# EAGLE design Codeshelf-0010.v01 (EAGLE 5.11)
MFG: Kobiconn; MFGN: SparkFun; MFGP: BOB-11611; PRICE: 34.95
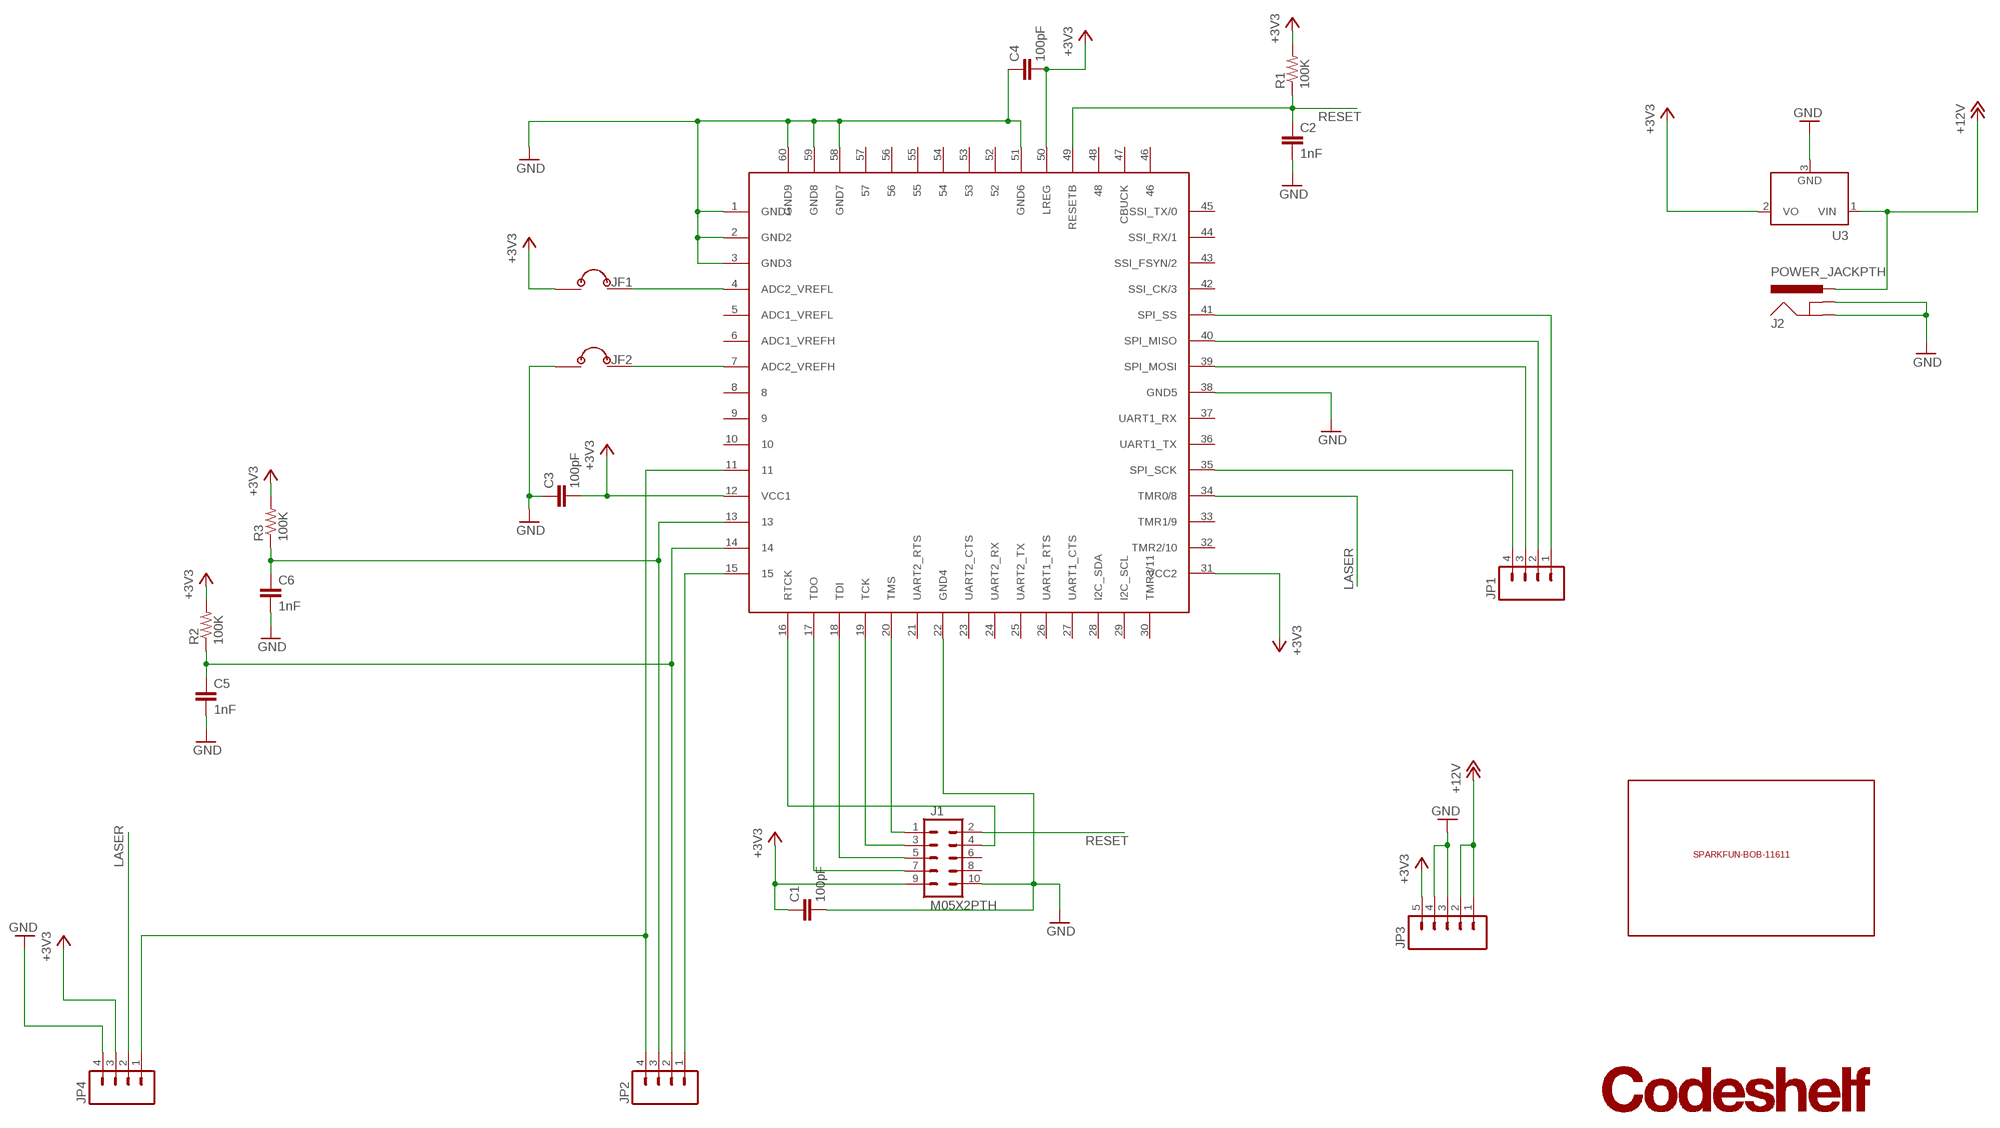
[diagram p0: schematic, sheet 1]

## Parts
C1  100pF  RF-C0603  [C0603]
C2  1nF  RF-C0603  [C0603]
C3  100pF  RF-C0603  [C0603]
C4  100pF  RF-C0603  [C0603]
C5  1nF  RF-C0603  [C0603]
C6  1nF  RF-C0603  [C0603]
J1  M05X2PTH  [AVR_ICSP]
J2  POWER_JACKPTH  [POWER_JACK_PTH]
JF1  JUMPER-2X-SMT-VIA  [JUMPER-VIA-2X]
JF2  JUMPER-2X-SMT-VIA  [JUMPER-VIA-2X]
JP1  M04PTH  [1X04]
JP2  M04PTH  [1X04]
JP3  M05PTH  [1X05]
JP4  M04PTH  [1X04]
LOGO  CODESHELF-LOGO  [CODESHELF-LOGO]
R1  100K  RF-R0402  [RF-R0402]
R2  100K  RF-R0402  [RF-R0402]
R3  100K  RF-R0402  [RF-R0402]
U1  ZSFM201-1A  [ZSFM201-1]
U3  LM2936DT-3.3  [TO252]
U$1  SPARKFUN-BOB-11611  [SPARKFUN-BOB-11611]

## Nets
#BUSY: C5.1 JP2.2 R2.1 U1.14
#FLAG: C6.1 JP2.3 R3.1 U1.13
#RESET: JP2.1 U1.15
+3V3 [3v3]: C1.1 C3.2 C4.2 J1.9 JF1.1 JP3.5 JP4.3 R1.2 R2.2 R3.2 U1.12(VCC1) U1.31(VCC2) U1.50(LREG) U3.2(VO)
+12V [12V]: J2.PWR JP3.1 JP3.2 U3.1(VIN)
GND [GND]: C1.2 C2.2 C3.1 C4.1 C5.2 C6.2 J1.10 J2.GND J2.GNDBREAK JF2.1 JP3.3 JP3.4 JP4.4 U1.1(GND1) U1.2(GND2) U1.3(GND3) U1.22(GND4) U1.38(GND5) U1.51(GND6) U1.58(GND7) U1.59(GND8) U1.60(GND9) U3.3(GND)
LASER: JP4.2 U1.34(TMR0/8)
N$6: JF2.2 U1.7(ADC2_VREFH)
N$7: JF1.2 U1.4(ADC2_VREFL)
RESET: C2.1 J1.2 R1.1 U1.49(RESETB)
RTCK: J1.4 U1.16(RTCK)
SPI_CLK: JP1.4 U1.35(SPI_SCK)
SPI_CS: JP1.1 U1.41(SPI_SS)
SPI_MISO: JP1.2 U1.40(SPI_MISO)
SPI_MOSI: JP1.3 U1.39(SPI_MOSI)
SWITCH: JP2.4 JP4.1 U1.11
TCK: J1.3 U1.19(TCK)
TDI: J1.5 U1.18(TDI)
TDO: J1.7 U1.17(TDO)
TMS: J1.1 U1.20(TMS)
Unconnected: J1.6 J1.8 U1.5(ADC1_VREFL) U1.6(ADC1_VREFH) U1.8 U1.9 U1.10 U1.21(UART2_RTS) U1.23(UART2_CTS) U1.24(UART2_RX) U1.25(UART2_TX) U1.26(UART1_RTS) U1.27(UART1_CTS) U1.28(I2C_SDA) U1.29(I2C_SCL) U1.30(TMR3/11) U1.32(TMR2/10) U1.33(TMR1/9) U1.36(UART1_TX) U1.37(UART1_RX) U1.42(SSI_CK/3) U1.43(SSI_FSYN/2) U1.44(SSI_RX/1) U1.45(SSI_TX/0) U1.46 U1.47(CBUCK) U1.48 U1.52 U1.53 U1.54 U1.55 U1.56 U1.57

## Library data of the parts
C1-C6 = GW-devices:RF-C: RF capacitor pads for FSL reference design
J1 = SparkFun:M05X2: Header 5x2 Standard 10-pin dual row 0.1" header. Commonly used with AVR-ISP. Use with Spark Fun Electronics SKU: PRT-00778
J2 = GW-devices:POWER_JACK: Power Jack This is the standard 5.5mm barrel jack for power. The PTH is the most common, proven, reliable, footprint. All others are experimental. The Slot footprint only works if the mill layer is transmitted to the PCB fab house so be warned. Spark Fun Electronics SKU : PRT-00119. Mating wall wart : TOL-00298 (and others)
JF1 JF2 = GW-devices:JUMPER-2X: This kind of jumper provides a place to place to put "green wires" for jumpering fetaure/options.
JP1 JP2 JP4 = SparkFun:M04: Header 4 Standard 4-pin 0.1" header. Use with straight break away headers (SKU : PRT-00116), right angle break away headers (PRT-00553), swiss pins (PRT-00743), machine pins (PRT-00117), and female headers (PRT-00115). Molex polarized connector foot print use with SKU : PRT-08231 with associated crimp pins and housings.
JP3 = SparkFun:M05: Header 5 Standard 5-pin 0.1" header. Use with straight break away headers (SKU : PRT-00116), right angle break away headers (PRT-00553), swiss pins (PRT-00743), machine pins (PRT-00117), and female headers (PRT-00115). Molex polarized connector foot print use with SKU : PRT-08230 with associated crimp pins and housings.
LOGO = GW-devices:CODESHELF-LOGO
R1-R3 = GW-devices:RF-R: RF resistor pads for FSL reference design
U1 = GW-devices:ZSFM201-1: The CEL MC13224V
U3 = national-semiconductor:LM2936?*: Ultra-Low Quiescent Current LDO Voltage Regulator Source: Data sheet <http://www.national.com/ds/LM/LM2936.pdf>; MPN: LM2936DT-3.3.; OC_FARNELL: 1286863; OC_NEWARK: 26M0361
U$1 = GW-devices:SPARKFUN-BOB-11611

## Net classes
1 3v3: width 0.5 mm
2 12V: width 1 mm
3 LASER: width 0.5 mm
4 GND: width 0.5 mm
5 RS485: width 0.4 mm

## Board
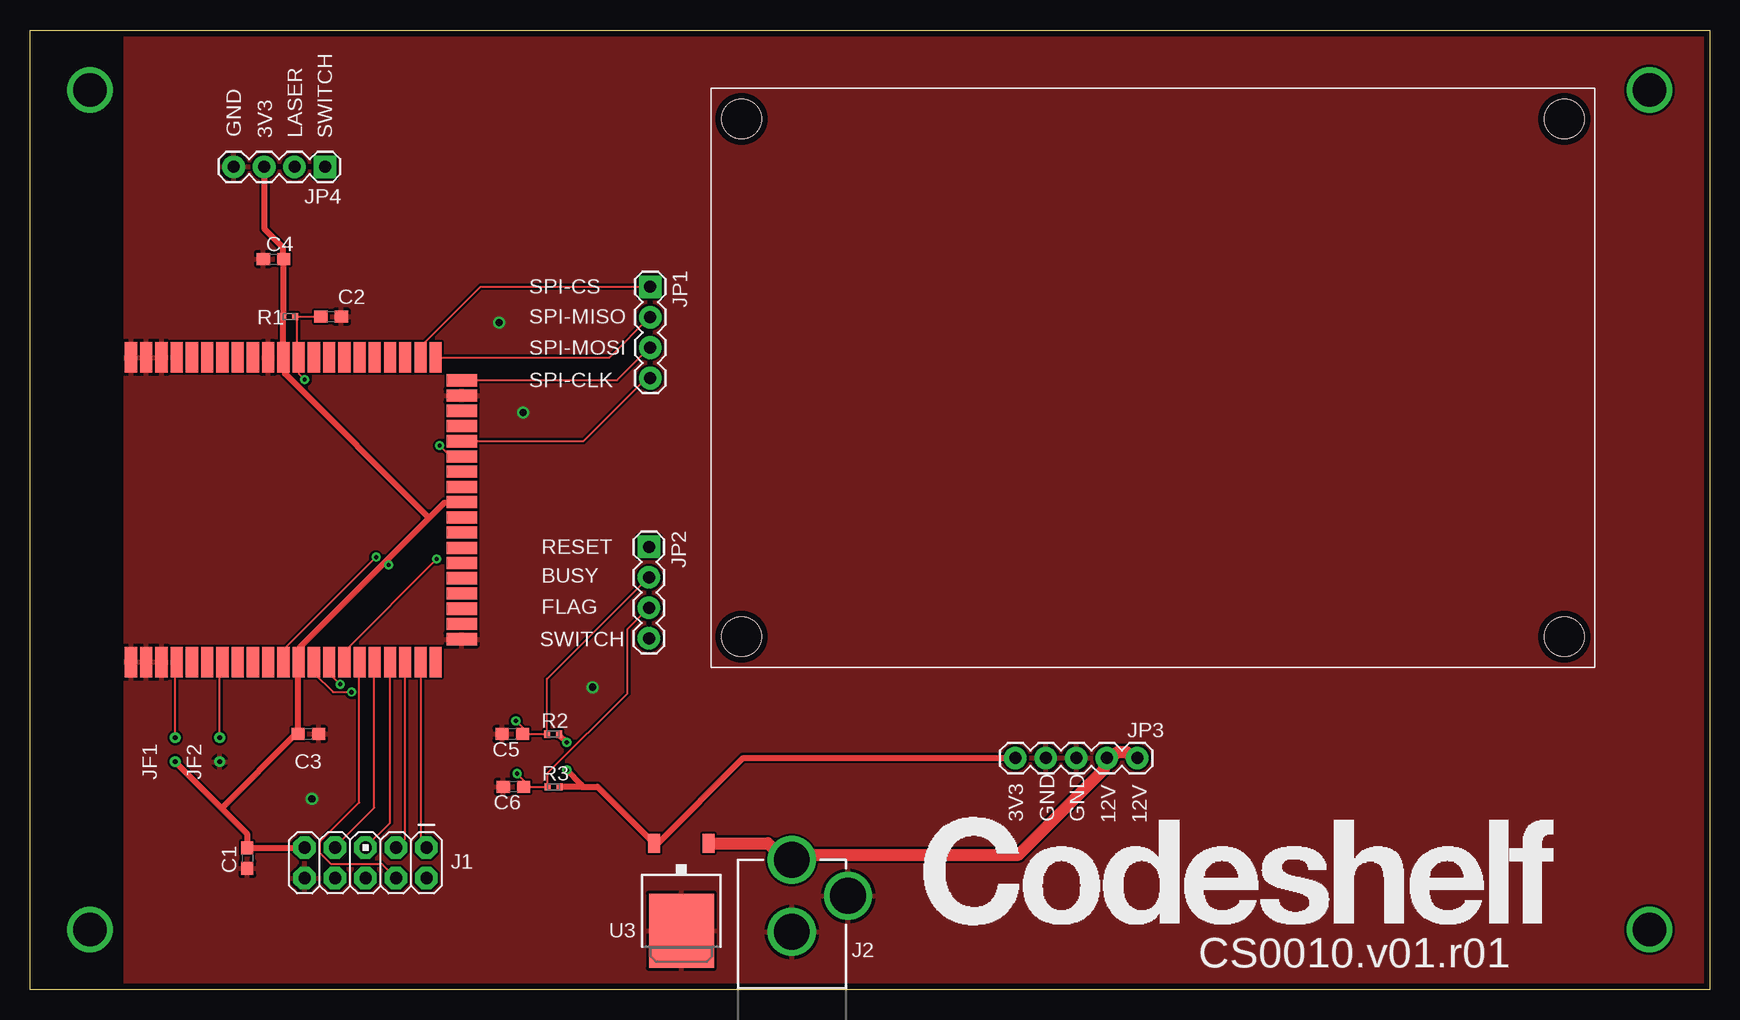
[diagram p1: board, top side]
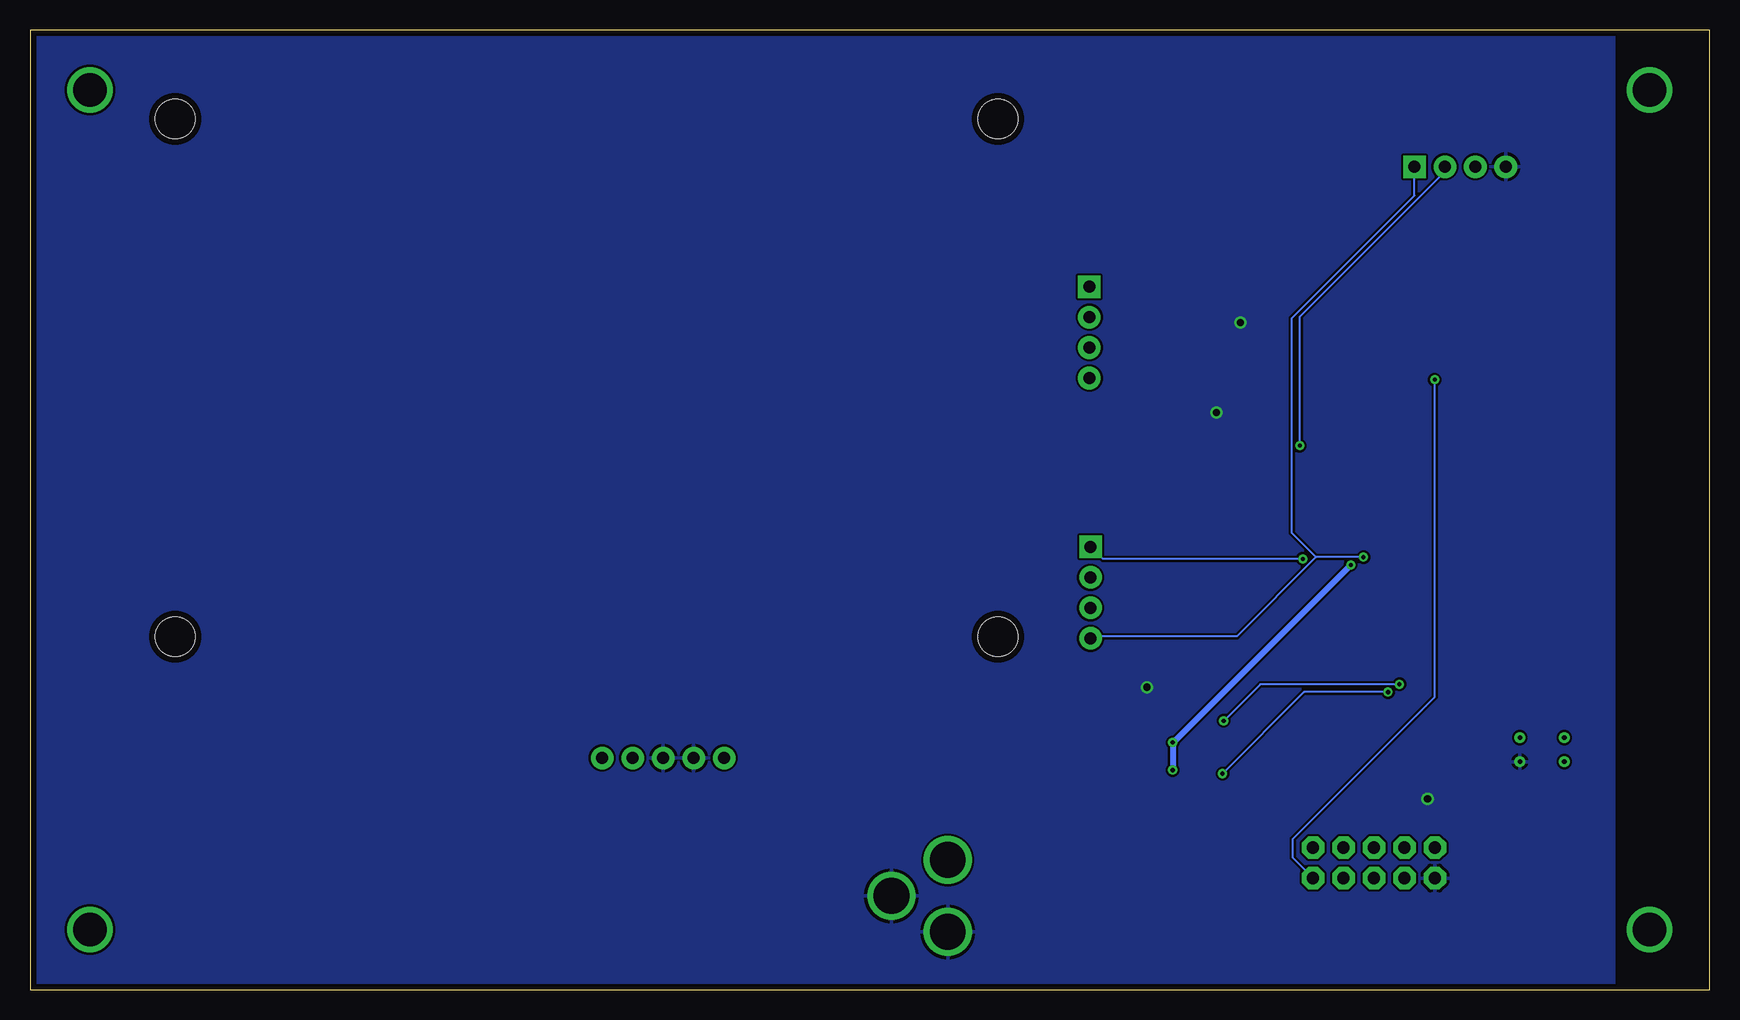
[diagram p2: board, bottom side, seen from below]

Size 140 x 80 mm. Coordinates in mm from the lower left corner, seen from the top.
Outline: 0,0 0,80 140,80 140,0 0,0
Copper layers (1*16): Top 0.0356mm / dielectric 1.5011mm / Bottom 0.0356mm
Design rules "SilverCircuits": minimum track width 7mil, minimum drill 14mil, track to track 7mil, track to pad 7mil, pad to pad 7mil, via to via 7mil, smd to smd 0mil, copper to edge 20mil, drill to drill 8mil, minimum pad ring 10mil, minimum via ring 8mil, stop-mask expansion 4mil, vias tented up to drill 0mil, thermal gap 10mil

### Footprints (pad centres in the part's own frame; a part is rotated, then mirrored left to right if it is on the bottom)
C0603 = smd 1.1 x 1: 1 -0.85,0; 2 0.85,0
AVR_ICSP = drill 1.016 pad 1.88 octagon: 1 -1.27,5.08; 2 1.27,5.08; 3 -1.27,2.54; 4 1.27,2.54; 5 -1.27,0; 6 1.27,0; 7 -1.27,-2.54; 8 1.27,-2.54; 9 -1.27,-5.08; 10 1.27,-5.08
POWER_JACK_PTH = drill 2.997: GND 0,7.7; GNDBREAK 4.7,10.7; PWR 0,13.7
JUMPER-VIA-2X = drill 0.4: 1 -1,0; 2 1,0
1X04 = drill 1.016 pad 1.88 square: 1 0,0 | drill 1.016 pad 1.88: 2 2.54,0; 3 5.08,0; 4 7.62,0
1X05 = drill 1.016 pad 1.88: 1 0,0; 2 2.54,0; 3 5.08,0; 4 7.62,0; 5 10.16,0
RF-R0402 = smd 0.5 x 0.6: 1 -0.5,0; 2 0.5,0
ZSFM201-1 = smd 2.54 x 1.016: 1 -12.7,28.829; 2 -12.7,27.559; 3 -12.7,26.289; 4 -12.7,25.019; 5 -12.7,23.749; 6 -12.7,22.479; 7 -12.7,21.209; 8 -12.7,19.939; 9 -12.7,18.669; 10 -12.7,17.399; 11 -12.7,16.129; 12 -12.7,14.859; 13 -12.7,13.589; 14 -12.7,12.319; 15 -12.7,11.049; 16 -12.7,9.779; 17 -12.7,8.509; 18 -12.7,7.239; 19 -12.7,5.969; 20 -12.7,4.699; 21 -12.7,3.429; 40 12.7,3.429; 41 12.7,4.699; 42 12.7,5.969; 43 12.7,7.239; 44 12.7,8.509; 45 12.7,9.779; 46 12.7,11.049; 47 12.7,12.319; 48 12.7,13.589; 49 12.7,14.859; 50 12.7,16.129; 51 12.7,17.399; 52 12.7,18.669; 53 12.7,19.939; 54 12.7,21.209; 55 12.7,22.479; 56 12.7,23.749; 57 12.7,25.019; 58 12.7,26.289; 59 12.7,27.559; 60 12.7,28.829 | smd 1.016 x 2.54: 22 -10.795,1.27; 23 -9.525,1.27; 24 -8.255,1.27; 25 -6.985,1.27; 26 -5.715,1.27; 27 -4.445,1.27; 28 -3.175,1.27; 29 -1.905,1.27; 30 -0.635,1.27; 31 0.635,1.27; 32 1.905,1.27; 33 3.175,1.27; 34 4.445,1.27; 35 5.715,1.27; 36 6.985,1.27; 37 8.255,1.27; 38 9.525,1.27; 39 10.795,1.27
TO252 = smd 1 x 1.6: 1 -2.28,-4.8; 2 2.28,-4.8 | smd 5.4 x 6.2: 3 0,2.5
SPARKFUN-BOB-11611 = hole 3.302: -34.29,-21.59; -34.29,21.59; 34.29,21.59; 34.29,-21.59

### Placement (x,y rotation side)
C1  18.11,10.96 270 top
C2  25.1,56.1 0 top
C3  23.2,21.3 180 top
C4  20.3,60.9 0 top
C5  40.2,21.3 180 top
C6  40.3,16.9 180 top
J1  27.97,10.56 270 top
J2  63.5,-2.9 0 top
JF1  12.1,20 90 top
JF2  15.8,20 90 top
JP1  51.7,58.6 270 top
JP2  51.6,36.9 270 top
JP3  92.3,19.3 180 top
JP4  24.6,68.6 180 top
LOGO  99.23,8.17 0 top
R1  21.6,56.1 180 top
R2  43.6,21.3 0 top
R3  43.65,16.9 0 top
U1  37.25,40 90 top
U3  54.3,7.4 180 top
U$1  93.6,51 0 top

### Tracks (layer width: path | path; a pad name or v marks a point on that pad's centre or on a via)
#BUSY  (via drill 0.36)
  Top 0.178: JP2.2 51.6,34.4 43.1,25.9 R2.1 C5.1 41.55,21.35 v40.5,22.4 | v25.85,25.45 24.95,26.35 24.95,27.3 U1.14
  Bottom 0.178: v25.85,25.45 37.45,25.45 v40.5,22.4
#FLAG  (via drill 0.36)
  Top 0.178: JP2.3 51.6,31.85 49.8,30.05 49.8,24.7 43.15,18.05 R3.1 C6.1 41.65,16.95 v40.6,18 | v26.8,24.8 25.25,24.8 23.7,26.35 23.7,27.3 U1.13
  Bottom 0.178: v26.8,24.8 33.8,24.8 v40.6,18
#RESET  (via drill 0.36)
  Top 0.178: v33.9,35.9 26.25,28.25 26.25,27.3 U1.15
  Bottom 0.178: v33.9,35.9 50.55,35.9 51.55,36.9 JP2.1
+3V3  (via drill 0.36)
  Top 0.5: 45.95,16.9 47.3,16.9 52,12.2 U3.2 52.25,12.1 59.45,19.3 JP3.5 | 45.95,16.9 R3.2 | R2.2 44.1,21.25 v44.75,20.6 | v44.75,18.3 45.95,17.1 45.95,16.9 | JP4.3 19.55,68.6 19.55,63.4 21.1,61.85 21.1,61.1 C4.2 21.15,56.3 R1.2 21.1,52.7 U1.50 21.25,52.5 21.25,51.35 33.27,39.33 | J1.9 22.85,11.8 18.15,11.8 C1.1 18.1,12.05 18.1,13 15.97,15.12 | JF1.1 15.97,15.12 | 29.62,35.67 22.5,28.55 22.5,27.5 U1.12 22.35,27.3 C3.2 22.15,21.3 15.97,15.12 | 29.62,35.67 33.27,39.33 | 33.27,39.33 34.55,40.6 35.95,40.6 U1.31 | 29.62,35.67 v29.9,35.4
  Bottom 0.5: v44.75,18.3 v44.75,20.6 44.55,20.75 v29.9,35.4
+12V
  Top 1: JP3.1 91.9,19.3 91.4,19.8 90.65,19.8 90.15,19.3 JP3.2 89.55,18.85 89.55,18.4 82.4,11.25 63.75,11.25 J2.PWR 62.9,10.8 61.5,12.2 U3.1
GND  (via drill 0.6)
  other vias: 41.1,48.1 23.5,15.9 39.1,55.6 46.9,25.2
  pour Bottom: 8,0 8,80 140,80 140,0
  pour Top: 8,0 8,80 140,80 140,0
LASER  (via drill 0.36)
  Top 0.178: v34.15,45.35 35.05,44.45 35.95,44.45 U1.34
  Bottom 0.178: v34.15,45.35 34.15,56.1 22.1,68.15 22.1,68.6 JP4.2
N$5  (via drill 2.8)
  other vias: 5,5
N$6
  Top 0.178: JF2.2 15.8,27.1 16,27.3 U1.7
N$7
  Top 0.178: JF1.2 12.1,27.2 12.2,27.3 U1.4
N$9  (via drill 2.8)
  other vias: 135,5
N$21  (via drill 2.8)
  other vias: 5,75
N$27  (via drill 2.8)
  other vias: 135,75
RESET  (via drill 0.36)
  Top 0.178: C2.1 R1.1 22.25,56.05 22.25,52.8 22.35,52.7 U1.49 22.45,52.65 22.45,51.3 v22.9,50.85
  Bottom 0.178: v22.9,50.85 22.9,24.4 34.75,12.55 34.75,11 J1.2
RTCK
  Top 0.178: U1.16 27.45,27.3 27.45,15.6 24.2,12.35 24.2,11.35 25.05,10.5 29.3,10.5 J1.4
SPI_CLK
  Top 0.178: U1.35 36,45.75 46.15,45.75 51.35,50.95 51.7,50.95 JP1.4
SPI_CS
  Top 0.178: JP1.1 37.55,58.6 32.6,53.65 32.6,52.7 U1.41
SPI_MISO
  Top 0.178: U1.40 48.3,52.7 51.7,56.1 JP1.2
SPI_MOSI
  Top 0.178: U1.39 36,50.8 48.95,50.8 51.7,53.55 JP1.3
SWITCH  (via drill 0.36)
  Top 0.178: v28.85,36.05 21.15,28.35 21.15,27.3 U1.11
  Bottom 0.178: v28.85,36.05 32.8,36.05 | 32.8,36.05 39.4,29.45 51.45,29.45 51.6,29.3 JP2.4 | JP4.1 24.6,66.2 34.8,56 34.8,38.05 32.8,36.05
TCK
  Top 0.178: U1.19 31.25,27.3 31.25,12.55 30.55,11.85 J1.3
TDI
  Top 0.178: U1.18 30,13.9 27.95,11.85 J1.5
TDO
  Top 0.178: U1.17 28.7,27.3 28.7,15.15 25.4,11.85 J1.7
TMS
  Top 0.178: U1.20 32.6,27.3 32.6,12.3 33.05,11.85 J1.1

### Text on the board
tPlace: GND | 3V3 | LASER | SWITCH | SPI-CS | SPI-MISO | SPI-MOSI | SPI-CLK | RESET | BUSY | FLAG | SWITCH | 3V3 | GND | GND | 12V | 12V | CS0010.v01.r01